# Altium schematic sheet Sheet1.SchDoc
size A4
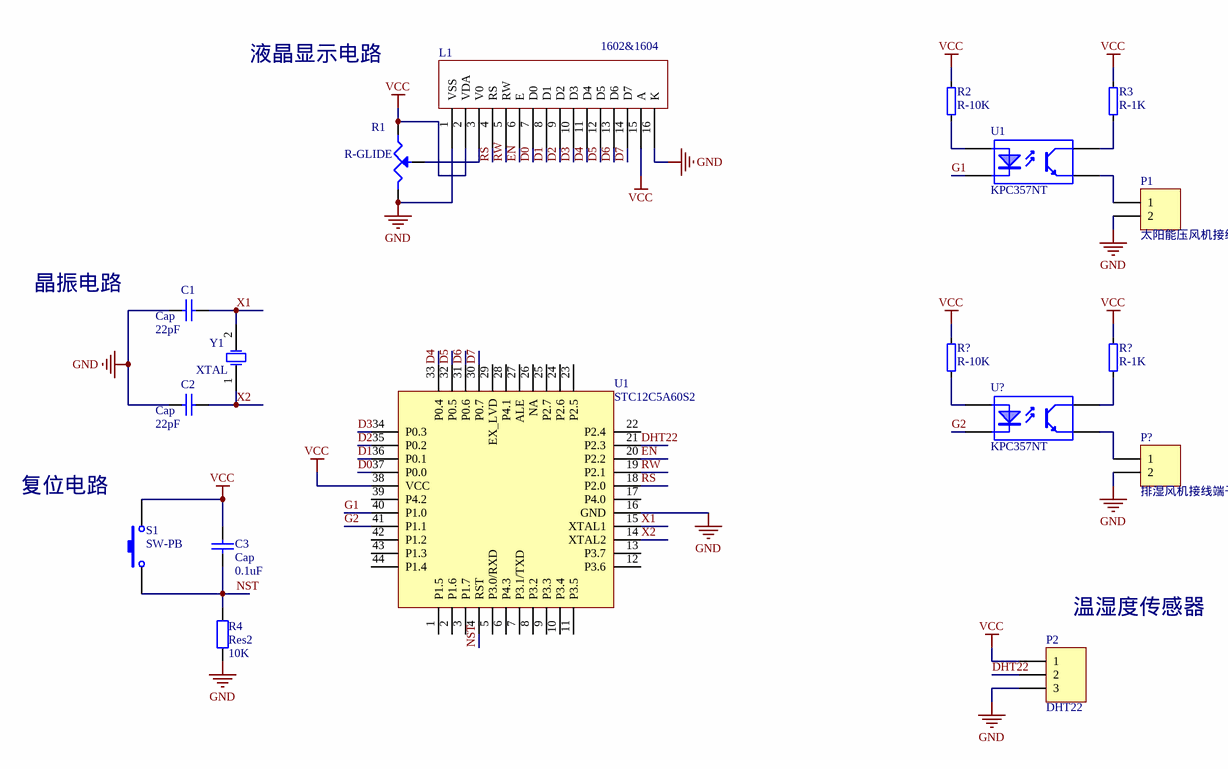
[diagram p0: Sheet1.SchDoc]

## Parts
(Parts that share a designator on the sheet are numbered #1, #2 ... from top to bottom, then left to right.)
C1  Cap  value 22pF  [RAD-0.3]
C2  Cap  value 22pF  [RAD-0.3]
C3  Cap  value 0.1uF  [RAD-0.3]
L1  1602&1604
P1  太阳能压风机接线端子  [HDR1X2]
P2  DHT22  [HDR1X3]
P?  排湿风机接线端子  [HDR1X2]
R1  R-GLIDE
R2  R-10K  [0805R]
R3  R-1K  [0805R]
R4  Res2  value 10K  [AXIAL-0.4]
R?#1  R-10K  [0805R]
R?#2  R-1K  [0805R]
S1  SW-PB  [SPST-2]
U1#1  KPC357NT  [DIP-4]
U1#2  STC12C5A60S2  [TQFP-44]
U?  KPC357NT  [DIP-4]
Y1  XTAL  [R38]

## Nets
GND: C1.1 C2.1 L1.1(VSS) L1.16(K) P1.2 P2.3 P?.2 R1.2 R4.1 U1#2.16(GND)
VCC: C3.2 L1.2(VDA) L1.15(A) P2.1 R1.1 R2.2 R3.2 R?#1.2 R?#2.2 S1.2 U1#2.38(VCC)
D0: L1.7(D0) U1#2.37(P0.0)
D1: L1.8(D1) U1#2.36(P0.1)
D2: L1.9(D2) U1#2.35(P0.2)
D3: L1.10(D3) U1#2.34(P0.3)
D4: L1.11(D4) U1#2.33(P0.4)
D5: L1.12(D5) U1#2.32(P0.5)
D6: L1.13(D6) U1#2.31(P0.6)
D7: L1.14(D7) U1#2.30(P0.7)
DHT22: P2.2 U1#2.21(P2.3)
EN: L1.6(E) U1#2.20(P2.2)
G1: U1#1.2(K) U1#2.40(P1.0)
G2: U1#2.41(P1.1) U?.2(K)
NST: C3.1 R4.2 S1.1 U1#2.4(RST)
RS: L1.4(RS) U1#2.18(P2.0)
RW: L1.5(RW) U1#2.19(P2.1)
X1: C1.2 U1#2.15(XTAL1) Y1.2(OSC2)
X2: C2.2 U1#2.14(XTAL2) Y1.1(OSC1)
NetL1_3: L1.3(V0) R1.3(W)
NetP1_1: P1.1 U1#1.3(E)
NetP?_1: P?.1 U?.3(E)
NetR2_1: R2.1 U1#1.1(A)
NetR3_1: R3.1 U1#1.4(C)
NetR?#1_1: R?#1.1 U?.1(A)
NetR?#2_1: R?#2.1 U?.4(C)

Not connected (* = marked no-connect by the designer): U1#2 1(P1.5) 2(P1.6) 3(P1.7) 5(P3.0/RXD) 6(P4.3) 7(P3.1/TXD) 8(P3.2) 9(P3.3) 10(P3.4) 11(P3.5) 12(P3.6) 13(P3.7) 17(P4.0) 22(P2.4) 23(P2.5) 24(P2.6) 25(P2.7) 26(NA) 27(ALE) 28(P4.1) 29(EX_LVD) 39(P4.2) 42(P1.2) 43(P1.3) 44(P1.4)

## Notes on the sheet
- 液晶显示电路
- 晶振电路
- 复位电路
- (near P2) 温湿度传感器

## Library data of the parts
C1-C3 = Cap: Capacitor; Published: 8-Jun-2000; LatestRevisionDate: 17-Jul-2002; LatestRevisionNote: Re-released for DXP Platform.; PackageReference: RAD-0.3; Publisher: Altium Limited; PackageDescription: Radial Cap, Thru-Hole; 2 Leads; 0.3 in Pin Spacing
P1 P? = Header 2: Header, 2-Pin; LatestRevisionDate: 17-Jul-2002; LatestRevisionNote: Re-released for DXP Platform.; Publisher: Altium Limited
P2 = Header 3: Header, 3-Pin; LatestRevisionDate: 17-Jul-2002; LatestRevisionNote: Re-released for DXP Platform.; Publisher: Altium Limited
R2 R3 R?#1 R?#2 = R-10K: resistor
R4 = Res2: Resistor; Published: 8-Jun-2000; LatestRevisionDate: 17-Jul-2002; LatestRevisionNote: Re-released for DXP Platform.; PackageReference: AXIAL-0.4; Publisher: Altium Limited; PackageDescription: Axial Device, Thru-Hole; 2 Leads; 0.4 in Pin Spacing
S1 = SW-PB: Switch; Published: 24-Mar-1999; LatestRevisionDate: 17-Jul-2002; LatestRevisionNote: Re-released for DXP Platform.; PackageReference: SPST-2; Publisher: Altium Limited; PackageDescription: Switch; 2 Leads
Y1 = XTAL: Crystal Oscillator; Published: 8-Jun-2000; LatestRevisionDate: 17-Jul-2002; LatestRevisionNote: Re-released for DXP Platform.; PackageReference: R38; Publisher: Altium Limited; PackageDescription: Crystal, Thru-Hole; 2 Leads; Body 3.1 x 8.2 mm (Dia.xH)
U1#1 U? = KPC357NT: Published: 24-Mar-1999; LatestRevisionDate: 17-Jul-2002; LatestRevisionNote: Re-released for DXP Platform.; Publisher: Altium Limited